# EAGLE design printTumblerRev1 (EAGLE 9.6.2)
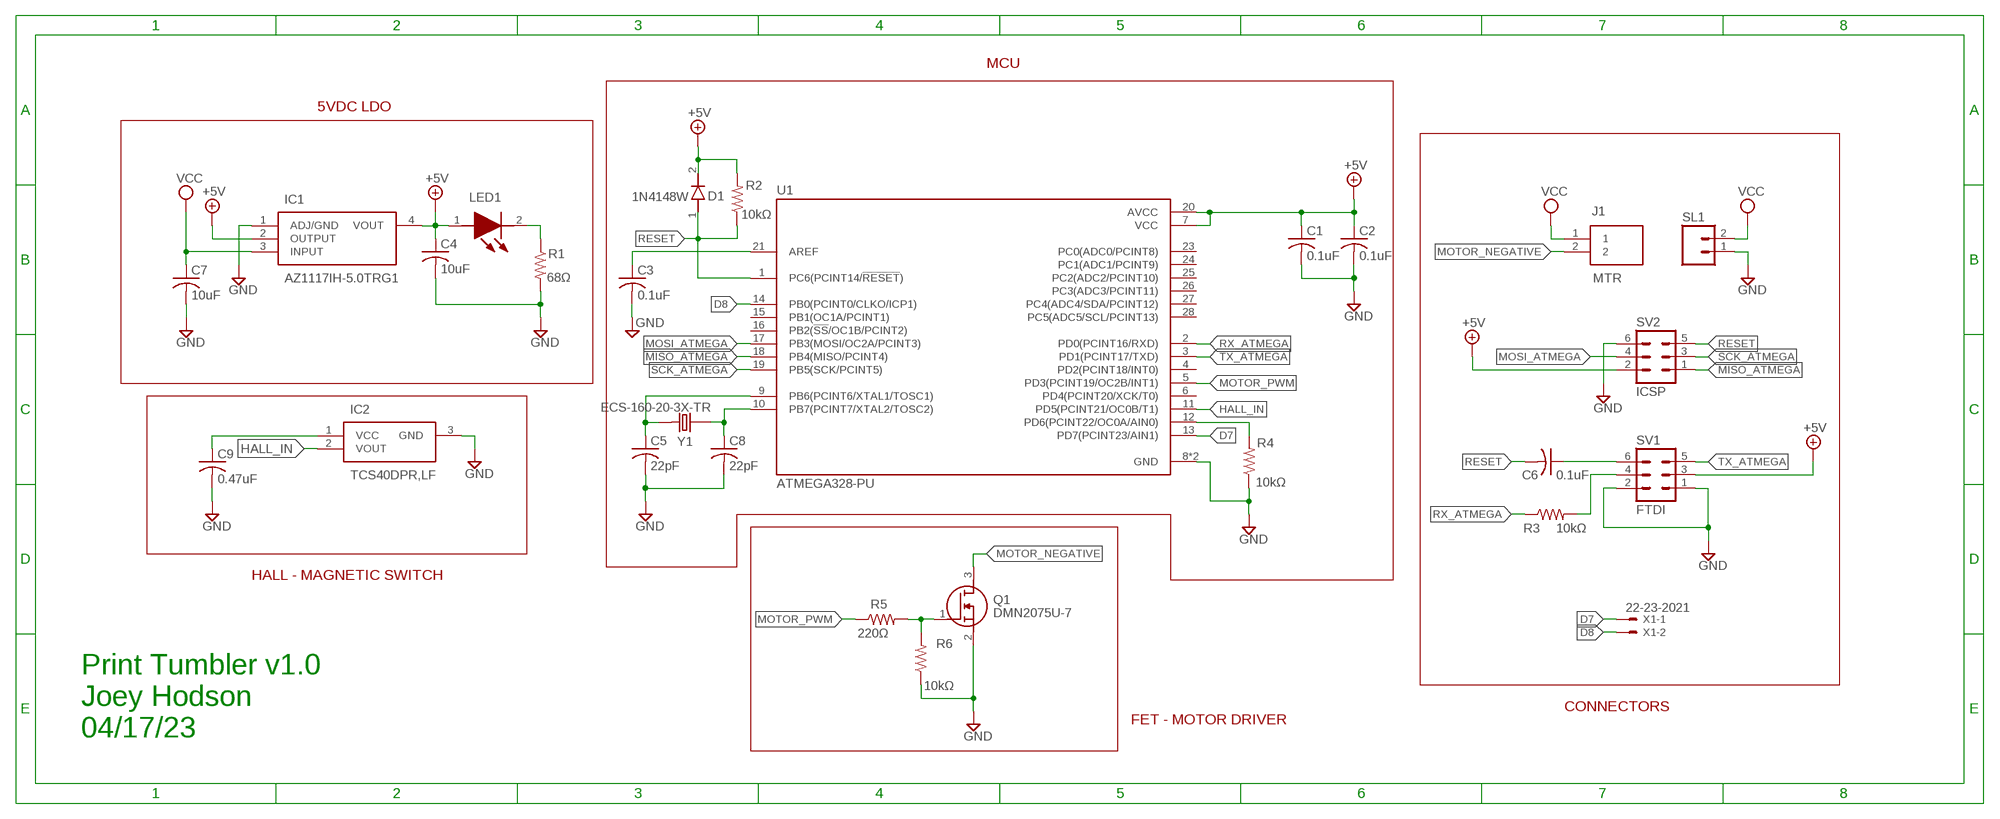
[diagram p0: schematic, sheet 1]

## Parts
C1  0.1uF  C-USC0603  [C0603]
C2  0.1uF  C-USC0603  [C0603]
C3  0.1uF  C-USC0603  [C0603]
C4  10uF  C-USC0805  [C0805]
C5  22pF  C-USC0603  [C0603]
C6  0.1uF  C-USC0603  [C0603]
C7  10uF  C-USC0805  [C0805]
C8  22pF  C-USC0603  [C0603]
C9  0.47uF  C-USC0603  [C0603]
D1  1N4148W  [SOD523F]
IC1  AZ1117IH-5.0TRG1  [SOT230P700X170-4N]
IC2  TCS40DPR,LF  [SOTFL95P240X88-3N]
J1  MTR  691214310002  [SHDR2W90P0X381_1X2_802X740X850]
LED1  SML-LX0603IW-TR  [SMLLX0603IWTR]
Q1  DMN2075U-7  [SOT96P240X100-3N]
R1  68Ω  R-US_R0603  [R0603]
R2  10kΩ  R-US_R0603  [R0603]
R3  10kΩ  R-US_R0603  [R0603]
R4  10kΩ  R-US_R0603  [R0603]
R5  220Ω  R-US_R0603  [R0603]
R6  10kΩ  R-US_R0603  [R0603]
SL1  M02  [02P]
SV1  FTDI  MA03-2  [MA03-2]
SV2  ICSP  MA03-2  [MA03-2]
U1  ATMEGA328-PU  [DIP787W46P254L3467H508Q28]
X1  22-23-2021  [22-23-2021]
Y1  ECS-160-20-3X-TR  [XTAL_ECS-160-20-3X-TR]

## Nets
+5V: C1.1 C2.1 C4.1 D1.2(C1) IC1.2(OUTPUT) IC1.4(VOUT) LED1.1(A) R2.2 SV1.3 SV2.2 U1.7(VCC) U1.20(AVCC)
D7: U1.13(PD7(PCINT23/AIN1)) X1.1
D8: U1.14(PB0(PCINT0/CLKO/ICP1)) X1.2
GND: C1.2 C2.2 C3.2 C4.2 C5.2 C7.2 C8.2 C9.2 IC1.1(ADJ/GND) IC2.3(GND) Q1.2(S) R1.2 R4.1 R6.1 SL1.1 SV1.1 SV1.2 SV2.6 U1.8(GND) U1.22(GND)
HALL_IN: IC2.2(VOUT) U1.11(PD5(PCINT21/OC0B/T1))
MISO_ATMEGA: SV2.1 U1.18(PB4(MISO/PCINT4))
MOSI_ATMEGA: SV2.4 U1.17(PB3(MOSI/OC2A/PCINT3))
MOTOR_NEGATIVE: J1.2 Q1.3(D)
MOTOR_PWM: R5.1 U1.5(PD3(PCINT19/OC2B/INT1))
N$1: C3.1 U1.21(AREF)
N$2: LED1.2(K) R1.1
N$3: C6.1 SV1.6
N$4: R3.2 SV1.4
N$6: C5.1 U1.9(PB6(PCINT6/XTAL1/TOSC1)) Y1.2
N$7: C8.1 U1.10(PB7(PCINT7/XTAL2/TOSC2)) Y1.1
N$8: C9.1 IC2.1(VCC)
N$9: R4.2 U1.12(PD6(PCINT22/OC0A/AIN0))
N$10: Q1.1(G) R5.2 R6.2
RESET: C6.2 D1.1(A1) R2.1 SV2.5 U1.1(PC6(PCINT14/!RESET!))
RX_ATMEGA: R3.1 U1.2(PD0(PCINT16/RXD))
SCK_ATMEGA: SV2.3 U1.19(PB5(SCK/PCINT5))
TX_ATMEGA: SV1.5 U1.3(PD1(PCINT17/TXD))
VCC: C7.1 IC1.3(INPUT) J1.1 SL1.2
Unconnected: U1.4(PD2(PCINT18/INT0)) U1.6(PD4(PCINT20/XCK/T0)) U1.15(PB1(OC1A/PCINT1)) U1.16(PB2(!SS!/OC1B/PCINT2)) U1.23(PC0(ADC0/PCINT8)) U1.24(PC1(ADC1/PCINT9)) U1.25(PC2(ADC2/PCINT10)) U1.26(PC3(ADC3/PCINT11)) U1.27(PC4(ADC4/SDA/PCINT12)) U1.28(PC5(ADC5/SCL/PCINT13))

## Notes on the sheet
- MCU
- 5VDC LDO
- HALL - MAGNETIC SWITCH
- CONNECTORS
- FET - MOTOR DRIVER
- Print Tumbler v1.0
  Joey Hodson
  04/17/23

## Library data of the parts
C1-C9 = rcl:C-US: CAPACITOR, American symbol; SPICEPREFIX: C
D1 = 1N4148W:1N4148W: Small signal diode. 150mA, 100V, SOD523F, RS: 761-4283 Fairchild Semiconductor Mfr. Part No. 1N4148WT Check availability <https://pricing.snapeda.com/parts/1N4148W/Diotec%20Semiconductor/view-part?ref=eda>; AVAILABILITY: In Stock; DESCRIPTION: Diode Small Signal Switching 100V 0.15A Automotive 2-Pin SOD-123F T/R; MF: Diotec Semiconductor; MP: 1N4148W; PACKAGE: SOD-123F-2 Diotec; PRICE: None; PURCHASE-URL: https://pricing.snapeda.com/search/part/1N4148W/?ref=eda
IC1 = AZ1117IH-5.0TRG1:AZ1117IH-5.0TRG1: LDO Voltage Regulators LDO BJT HiCurr 1.35A 10Hz to 10KHz Source: Datasheet <https://www.diodes.com/assets/Datasheets/AZ1117I.pdf>; ARROW_PART_NUMBER: AZ1117IH-5.0TRG1; ARROW_PRICE-STOCK: https://www.arrow.com/en/products/az1117ih-5.0trg1/diodes-incorporated?region=nac; DESCRIPTION: LDO Voltage Regulators LDO BJT HiCurr 1.35A 10Hz to 10KHz; HEIGHT: 1.7mm; MANUFACTURER_NAME: Diodes Inc.; MANUFACTURER_PART_NUMBER: AZ1117IH-5.0TRG1; MOUSER_PART_NUMBER: 621-AZ1117IH-5.0TRG1; MOUSER_PRICE-STOCK: https://www.mouser.co.uk/ProductDetail/Diodes-Incorporated/AZ1117IH-5.0TRG1?qs=cpo3%2FpBou2jpUVbxjr50ag%3D%3D
IC2 = TCS40DPR_LF:TCS40DPR,LF: Board Mount Hall Effect / Magnetic Sensors Magnetic Sensor Push Pull Dual Detection Source: Datasheet <http://toshiba.semicon-storage.com/info/docget.jsp?did=30107&prodName=TCS40DPR>; ARROW_PART_NUMBER: TCS40DPR,LF; ARROW_PRICE-STOCK: https://www.arrow.com/en/products/tcs40dprlf/toshiba?region=nac; DESCRIPTION: Board Mount Hall Effect / Magnetic Sensors Magnetic Sensor Push Pull Dual Detection; HEIGHT: 0.88mm; MANUFACTURER_NAME: Toshiba; MANUFACTURER_PART_NUMBER: TCS40DPR,LF; MOUSER_PART_NUMBER: 757-TCS40DPRLF; MOUSER_PRICE-STOCK: https://www.mouser.co.uk/ProductDetail/Toshiba/TCS40DPRLF?qs=GSXfdiLIrOHqR%252B5sANTKJA%3D%3D
J1 = 691214310002:691214310002: Wurth Elektronik 2143, 2 Way PCB Terminal Block Source: Datasheet <http://uk.rs-online.com/web/p/products/1918756>; DESCRIPTION: Wurth Elektronik 2143, 2 Way PCB Terminal Block; HEIGHT: 8.5mm; MANUFACTURER_NAME: Wurth Elektronik; MANUFACTURER_PART_NUMBER: 691214310002; MOUSER_PART_NUMBER: 710-691214310002; MOUSER_PRICE-STOCK: https://www.mouser.co.uk/ProductDetail/Wurth-Elektronik/691214310002?qs=sPbYRqrBIVnJ8j3in%252B4Wbg%3D%3D
LED1 = SML-LX0603IW-TR:SML-LX0603IW-TR: 2.5 V Red LED 1613 (0605) SMD, Lumex SML-LX0603IW-TR Source: Datasheet <https://www.lumex.com/led-smd-0603.html>; ARROW_PART_NUMBER: SML-LX0603IW-TR; ARROW_PRICE-STOCK: https://www.arrow.com/en/products/sml-lx0603iw-tr/lumex?region=nac; DESCRIPTION: 2.5 V Red LED 1613 (0605) SMD, Lumex SML-LX0603IW-TR; HEIGHT: mm; MANUFACTURER_NAME: Lumex; MANUFACTURER_PART_NUMBER: SML-LX0603IW-TR; MOUSER_PART_NUMBER: 696-SML-LX0603IW; MOUSER_PRICE-STOCK: https://www.mouser.co.uk/ProductDetail/Lumex/SML-LX0603IW-TR?qs=Ma3pWdXK8s%2FPxoga78z1xA%3D%3D
Q1 = DMN2075U-7:DMN2075U-7: Diodes Inc DMN2075U-7 N-channel MOSFET Transistor, 4.2 A, 20 V, 3-Pin SOT-23 Source: Datasheet <https://componentsearchengine.com/Datasheets/2/DMN2075U-7.pdf>; ARROW_PART_NUMBER: DMN2075U-7; ARROW_PRICE-STOCK: https://www.arrow.com/en/products/dmn2075u-7/diodes-incorporated; DESCRIPTION: Diodes Inc DMN2075U-7 N-channel MOSFET Transistor, 4.2 A, 20 V, 3-Pin SOT-23; HEIGHT: 1mm; MANUFACTURER_NAME: Diodes Inc.; MANUFACTURER_PART_NUMBER: DMN2075U-7; MOUSER_PART_NUMBER: 621-DMN2075U-7; MOUSER_PRICE-STOCK: https://www.mouser.co.uk/ProductDetail/Diodes-Incorporated/DMN2075U-7/?qs=GWgl%252BsiMZr%252BLQCBjmnsPIw%3D%3D
R1-R6 = rcl:R-US_: RESISTOR, American symbol; SPICEPREFIX: R
SL1 = con-amp-quick:M02: AMP QUICK CONNECTOR; OC_FARNELL: unknown; OC_NEWARK: unknown
SV1 SV2 = con-lstb:MA03-2: PIN HEADER; OC_FARNELL: unknown; OC_NEWARK: unknown
U1 = ATMEGA328-PU:ATMEGA328-PU: Check availability <https://pricing.snapeda.com/parts/ATMEGA328PU/Microchip%20Technology/view-part?ref=eda>; AVAILABILITY: In Stock; DESCRIPTION: MCU, 8BIT, ATMEGA, 20MHZ, DIP-28; Product Range:AVR ATmega Family ATmega328 Series Microcontrollers; CPU Speed:20MHz; Program Memory Size:32KB; RAM Memory Size:2KB; No. of Pins:28Pins; MCU Case Style:DIP; No. of I/O's:23I/O's; Embedded Interface Type:I2C, SPI, UART; Supply Voltage Min:1.8V; Supply Voltage Max:5.5V; MCU Family:AVR ATmega; MCU Series:ATmega328; Automotive Qualification Standard:-; RoHS Phthalates Compliant:Yes; MSL:-; SVHC:No SVHC (27-Jun-2018); Controller Family/Series:ATmega; EEPROM Memory Size:1KB; MPU Core Size:8bit; No. of PWM Channels:6; No. of Timers:3; Operating Temperature Max:85°C; Operating Temperature Min:-40°C; Operating Temperature Range:-40°C to +85°C; Oscillator Type:External, Internal; Peripherals:ACMP, ADC, POR, PWM, RTC; Program Memory Size:32KB; Supply Voltage Range:1.8V to 5.5V; MF: Microchip Technology; MP: ATMEGA328PU; PACKAGE: DIP-28 Microchip Technology; PRICE: None; PURCHASE-URL: https://pricing.snapeda.com/search/part/ATMEGA328PU/?ref=eda
X1 = con-molex:22-23-2021: .100" (2.54mm) Center Header - 2 Pin; MF: MOLEX; MPN: 22-23-2021; OC_FARNELL: 1462926; OC_NEWARK: 25C3832
Y1 = ECS-160-20-3X-TR:ECS-160-20-3X-TR: SMD QUARTZ CRYSTAL Check availability <https://pricing.snapeda.com/parts/ECS-160-20-3X-TR/ECS%20Inc./view-part?ref=eda>; AVAILABILITY: In Stock; DESCRIPTION: 16 MHz ±30ppm Crystal 20pF 50 Ohms HC-49/US; MF: ECS Inc.; MP: ECS-160-20-3X-TR; PACKAGE: HC49/US ECS International; PRICE: None; PURCHASE-URL: https://pricing.snapeda.com/search/part/ECS-160-20-3X-TR/?ref=eda

## Board
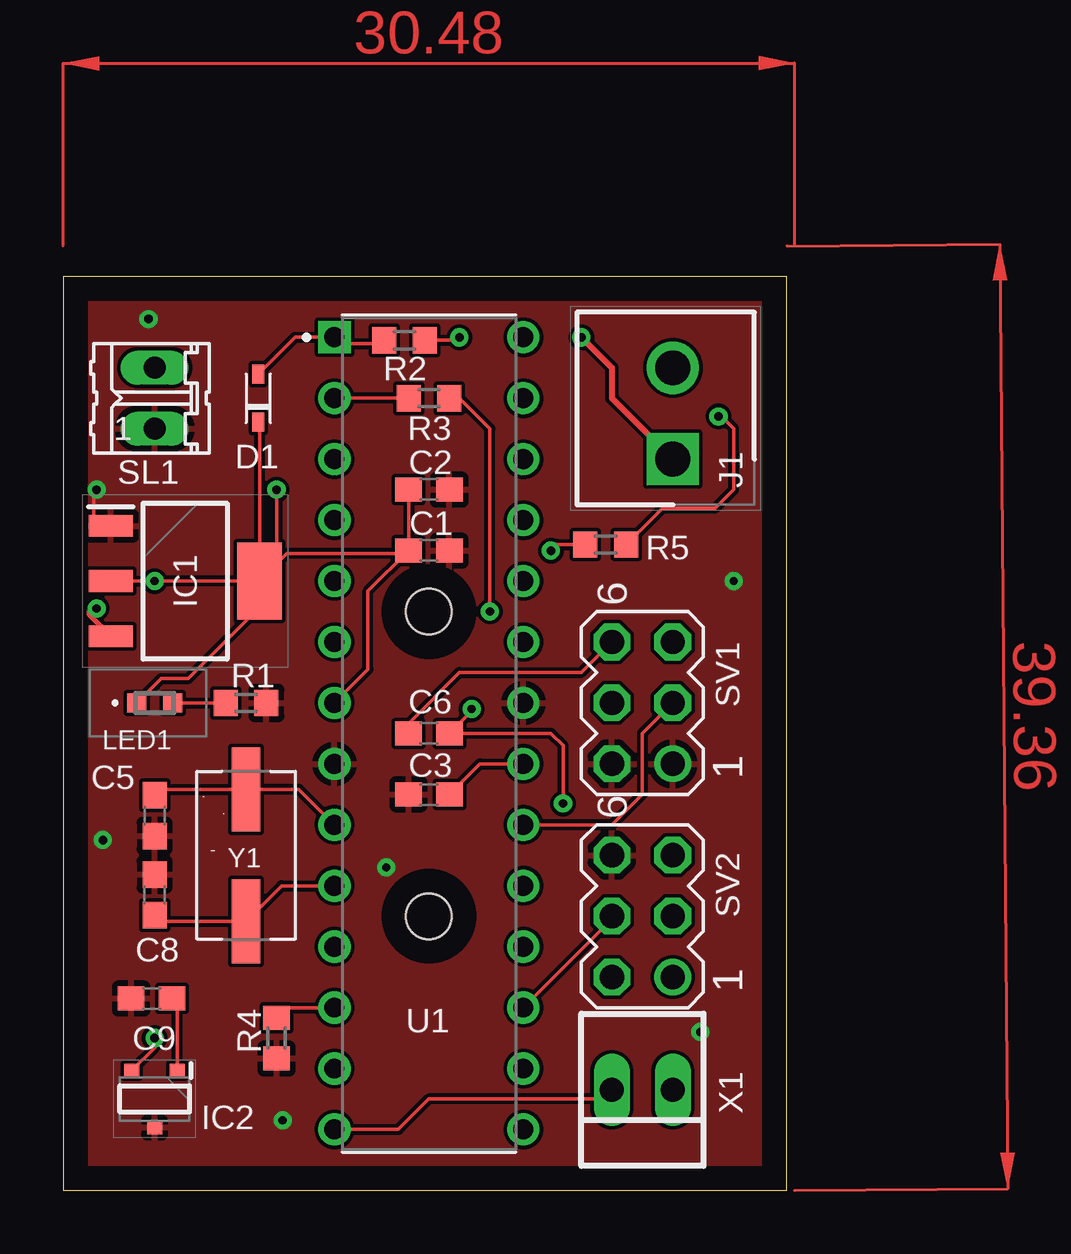
[diagram p1: board, top side]
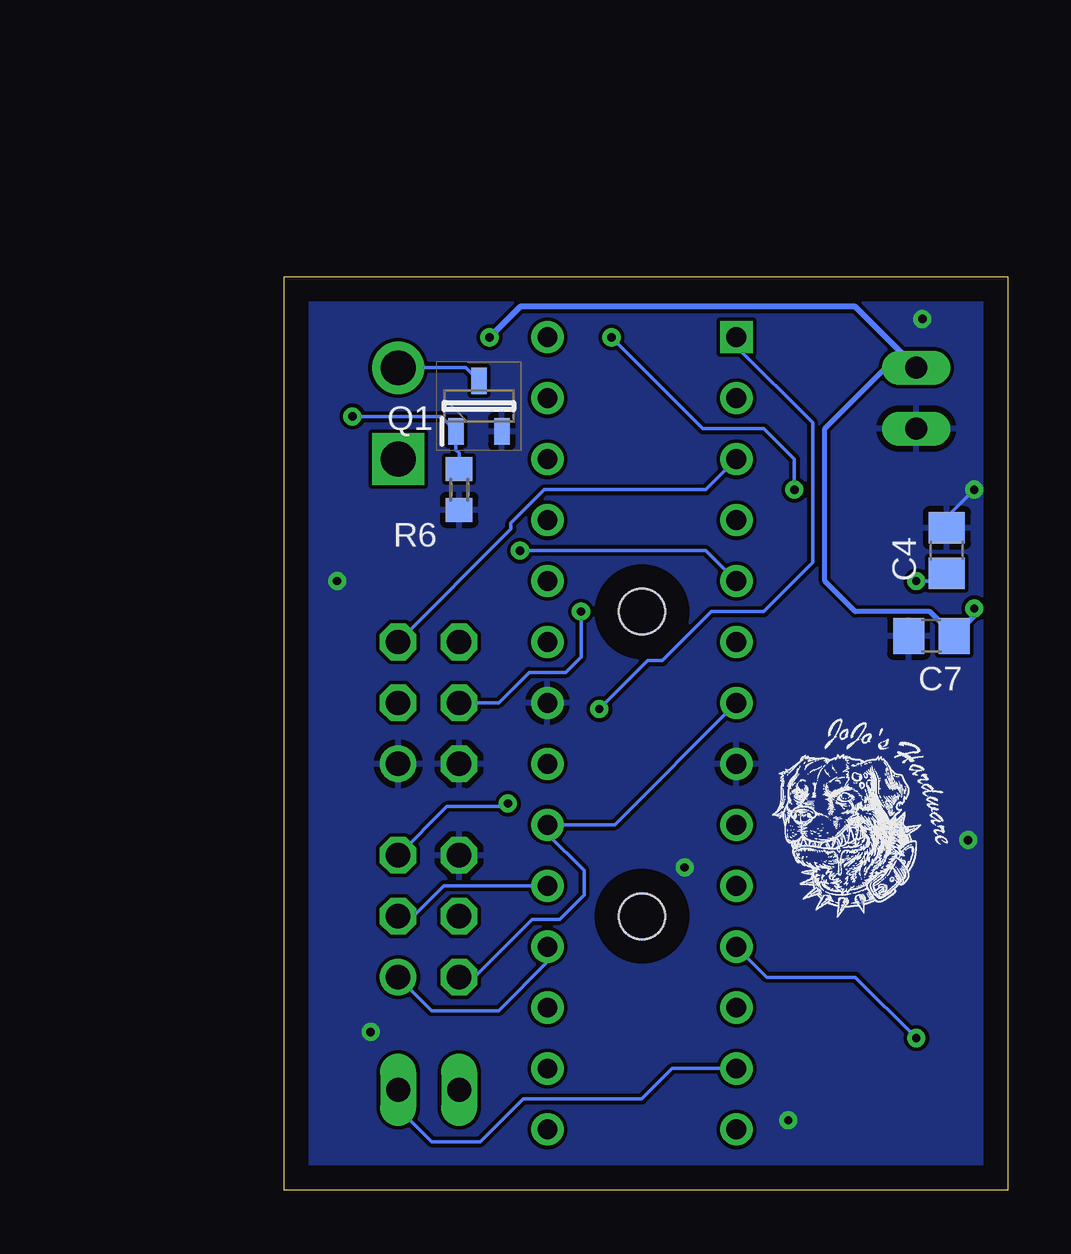
[diagram p2: board, bottom side, seen from below]

Size 30.15 x 38.09 mm. Coordinates in mm from the lower left corner, seen from the top.
Outline: 0,0 30.15,0 30.15,38.09 0,38.09 0,0
Copper layers (1*16): Top 0.035mm / dielectric 1.5mm / Bottom 0.035mm
Design rules "default": minimum track width 6mil, minimum drill 0.35mm, track to track 6mil, track to pad 6mil, pad to pad 6mil, via to via 6mil, smd to smd 6mil, copper to edge 40mil, drill to drill 6mil, minimum pad ring 10mil, minimum via ring 8mil, stop-mask expansion 4mil, vias tented up to drill 0mil, thermal gap 10mil
Holes 1.91 mm at 15.24,11.43 15.24,24.13

### Footprints (pad centres in the part's own frame; a part is rotated, then mirrored left to right if it is on the bottom)
C0603 = smd 1.1 x 1: 1 -0.85,0; 2 0.85,0
C0805 = smd 1.3 x 1.5: 1 -0.95,0; 2 0.95,0
SOD523F = smd 0.8 x 0.5: 1 -1,0; 2 1,0
SOT230P700X170-4N = smd 1.85 x 0.9: 1 -3.1,2.3; 2 -3.1,0; 3 -3.1,-2.3 | smd 1.85 x 3.2: 4 3.1,0
SOTFL95P240X88-3N = smd 0.575 x 0.62: 1 -1.188,0.95; 2 -1.188,-0.95; 3 1.188,0
SHDR2W90P0X381_1X2_802X740X850 = drill 1.45 pad 2.175 square: 1 0,0 | drill 1.45 pad 2.175: 2 3.81,0
SMLLX0603IWTR = smd 0.8 x 0.8: 1 -0.75,0; 2 0.75,0
SOT96P240X100-3N = smd 1.1 x 0.65: 1 -1.05,0.96; 2 -1.05,-0.96; 3 1.05,0
R0603 = smd 1 x 1.1: 1 -0.85,0; 2 0.85,0
02P = drill 0.914 long: 1 -1.27,0; 2 1.27,0
MA03-2 = drill 1.016: 1 -2.54,-1.27 | drill 1.016 octagon: 2 -2.54,1.27; 3 0,-1.27; 4 0,1.27; 5 2.54,-1.27; 6 2.54,1.27
DIP787W46P254L3467H508Q28 = drill 0.83 pad 1.25 square: 1 -3.937,16.51 | drill 0.83 pad 1.25: 2 -3.937,13.97; 3 -3.937,11.43; 4 -3.937,8.89; 5 -3.937,6.35; 6 -3.937,3.81; 7 -3.937,1.27; 8 -3.937,-1.27; 9 -3.937,-3.81; 10 -3.937,-6.35; 11 -3.937,-8.89; 12 -3.937,-11.43; 13 -3.937,-13.97; 14 -3.937,-16.51; 15 3.937,-16.51; 16 3.937,-13.97; 17 3.937,-11.43; 18 3.937,-8.89; 19 3.937,-6.35; 20 3.937,-3.81; 21 3.937,-1.27; 22 3.937,1.27; 23 3.937,3.81; 24 3.937,6.35; 25 3.937,8.89; 26 3.937,11.43; 27 3.937,13.97; 28 3.937,16.51
22-23-2021 = drill 1 long: 1 -1.27,0; 2 1.27,0
XTAL_ECS-160-20-3X-TR = smd 3.5 x 1.2: 1 -2.75,0; 2 2.75,0

### Placement (x,y rotation side)
C1  15.24,26.67 0 top
C2  15.24,29.21 0 top
C3  15.24,16.51 180 top
C4  2.54,26.67 90 bottom
C5  3.81,15.62 270 top
C6  15.24,19.05 0 top
C7  3.17,23.11 180 bottom
C8  3.81,12.32 90 top
C9  3.68,8 180 top
D1  8.13,33.02 270 top
IC1  5.08,25.4 0 top
IC2  3.81,3.81 270 top
J1  25.4,30.48 90 top
LED1  3.81,20.32 0 top
Q1  22.03,32.69 90 bottom
R1  7.62,20.32 0 top
R2  14.22,35.43 0 top
R3  15.24,33.02 0 top
R4  8.89,6.35 90 top
R5  22.61,26.92 0 top
R6  22.86,29.21 90 bottom
SL1  3.81,33.02 90 top
SV1  24.13,20.32 90 top
SV2  24.13,11.43 90 top
U1  15.24,19.05 0 top
X1  24.13,4.19 180 top
Y1  7.62,13.97 90 top

### Tracks (layer width: path | path; a pad name or v marks a point on that pad's centre or on a via)
+5V  (via drill 0.35)
  Top 0.152: IC1.4 8.18,31.97 D1.2 | IC1.2 v3.81,25.4 IC1.4 | LED1.1 4.08,21.34 5.21,21.34 8.18,24.31 IC1.4 | IC1.4 9.32,26.54 14.26,26.54 C1.1 | C2.1 C1.1 | U1.7 12.7,21.72 12.7,24.98 C1.1 | SV1.3 24.13,19.05 24.13,16.51 22.86,15.24 U1.20 | R2.2 16.38,35.43 v16.51,35.56 | v8.89,29.21 8.89,26.11 IC1.4
  Bottom 0.152: v3.81,25.4 2.86,25.4 C4.1 | U1.7 16.38,15.24 U1.20 19.18,14.86 17.65,13.34 17.65,12.32 18.67,11.3 19.81,11.3 22.22,8.89 SV2.2 | v16.51,35.56 12.7,31.75 10.16,31.75 8.89,30.48 v8.89,29.21
D7
  Bottom 0.152: U1.13 13.97,5.08 15.24,3.81 20.19,3.81 21.97,2.03 24,2.03 25.4,3.43 X1.1
D8
  Top 0.152: U1.14 13.97,2.54 15.24,3.81 22.48,3.81 X1.2
GND  (via drill 0.35)
  Top 0.152: v1.39,29.21 1.27,29.09 1.27,27.94 1.51,27.7 IC1.1
  Bottom 0.152: C4.2 2.54,28.06 v1.39,29.21
  other vias: 3.56,36.32 9.14,2.92 26.54,6.6 27.94,25.4 13.46,13.46 1.65,14.6
  pour Top: 0,38.1 0,0 30.1,0 30.1,38.1
  pour Bottom: 0,38.1 0,0 30.48,0 30.48,38.1
HALL_IN  (via drill 0.35)
  Top 0.152: IC2.2 3.81,5.95 v3.81,6.35
  Bottom 0.152: v3.81,6.35 6.35,8.89 10.03,8.89 U1.11
MISO_ATMEGA
  Bottom 0.152: U1.18 19.18,9.52 21.21,7.49 24,7.49 SV2.1
MOSI_ATMEGA
  Top 0.152: U1.17 22.86,11.3 SV2.4
MOTOR_NEGATIVE
  Bottom 0.152: Q1.3 22.59,34.29 J1.2
MOTOR_PWM  (via drill 0.35)
  Top 0.152: v20.32,26.67 20.57,26.92 R5.1
  Bottom 0.152: U1.5 12.57,26.67 v20.32,26.67
N$1
  Top 0.152: C3.1 17.36,17.78 U1.21
N$2
  Top 0.152: LED1.2 R1.1
N$3
  Top 0.152: C6.1 14.39,19.47 16.51,21.59 21.59,21.59 SV1.6
N$4  (via drill 0.35)
  Top 0.152: v17.78,24.13 17.78,31.75 16.51,33.02 R3.2
  Bottom 0.152: SV1.4 21.21,20.32 19.94,21.59 18.41,21.59 17.78,22.23 v17.78,24.13
N$6
  Top 0.152: C5.1 4.06,16.72 Y1.2 9.82,16.72 U1.9
N$7
  Top 0.152: C8.1 4.06,11.22 Y1.1 9.1,12.7 U1.10
N$8
  Top 0.152: IC2.1 4.76,7.77 C9.1
N$9
  Top 0.152: R4.2 9.31,7.62 U1.12
N$10  (via drill 0.35)
  Top 0.152: R5.2 24.98,28.45 27.18,28.45 27.94,29.21 27.94,31.75 27.43,32.26 v27.3,32.26
  Bottom 0.152: v27.3,32.26 23.61,32.26 Q1.1 22.99,30.87 22.86,30.73 R6.2
RESET  (via drill 0.35)
  Top 0.152: D1.1 9.67,35.56 U1.1 11.68,35.56 11.94,35.31 13.25,35.31 R2.1 | v20.83,16.13 20.83,18.54 20.32,19.05 C6.2 17.02,19.98 v17.02,20.07
  Bottom 0.152: v20.83,16.13 20.95,16 23.37,16 SV2.5 | v17.02,20.07 15,22.09 14.39,22.09 12.35,24.13 10.16,24.13 8.13,26.16 8.13,32 11.3,35.18 U1.1
RX_ATMEGA
  Top 0.152: R3.1 U1.2
SCK_ATMEGA
  Bottom 0.152: 25.27,11.3 SV2.3 24.77,11.43 23.49,12.7 U1.19
TX_ATMEGA
  Bottom 0.152: SV1.5 20.7,27.56 20.7,27.81 19.3,29.21 12.57,29.21 U1.3
VCC  (via drill 0.35)
  Top 0.2: IC1.3 1.09,23.99 1.09,24.13 1.22,24.26 v1.39,24.26
  Top 0.254: v21.59,35.56 22.86,34.29 22.86,33.02 J1.1
  Bottom 0.152: SL1.2 5.08,34.29
  Bottom 0.2: v1.39,24.26 1.39,23.95 C7.1 3.24,24.13 6.35,24.13 7.62,25.4 7.62,31.75 5.08,34.29
  Bottom 0.254: SL1.2 6.35,36.83 20.32,36.83 v21.59,35.56
(copper drawn outside any net)
  shapes: Top area x2